# EAGLE design 09F-02 (EAGLE 6.3)
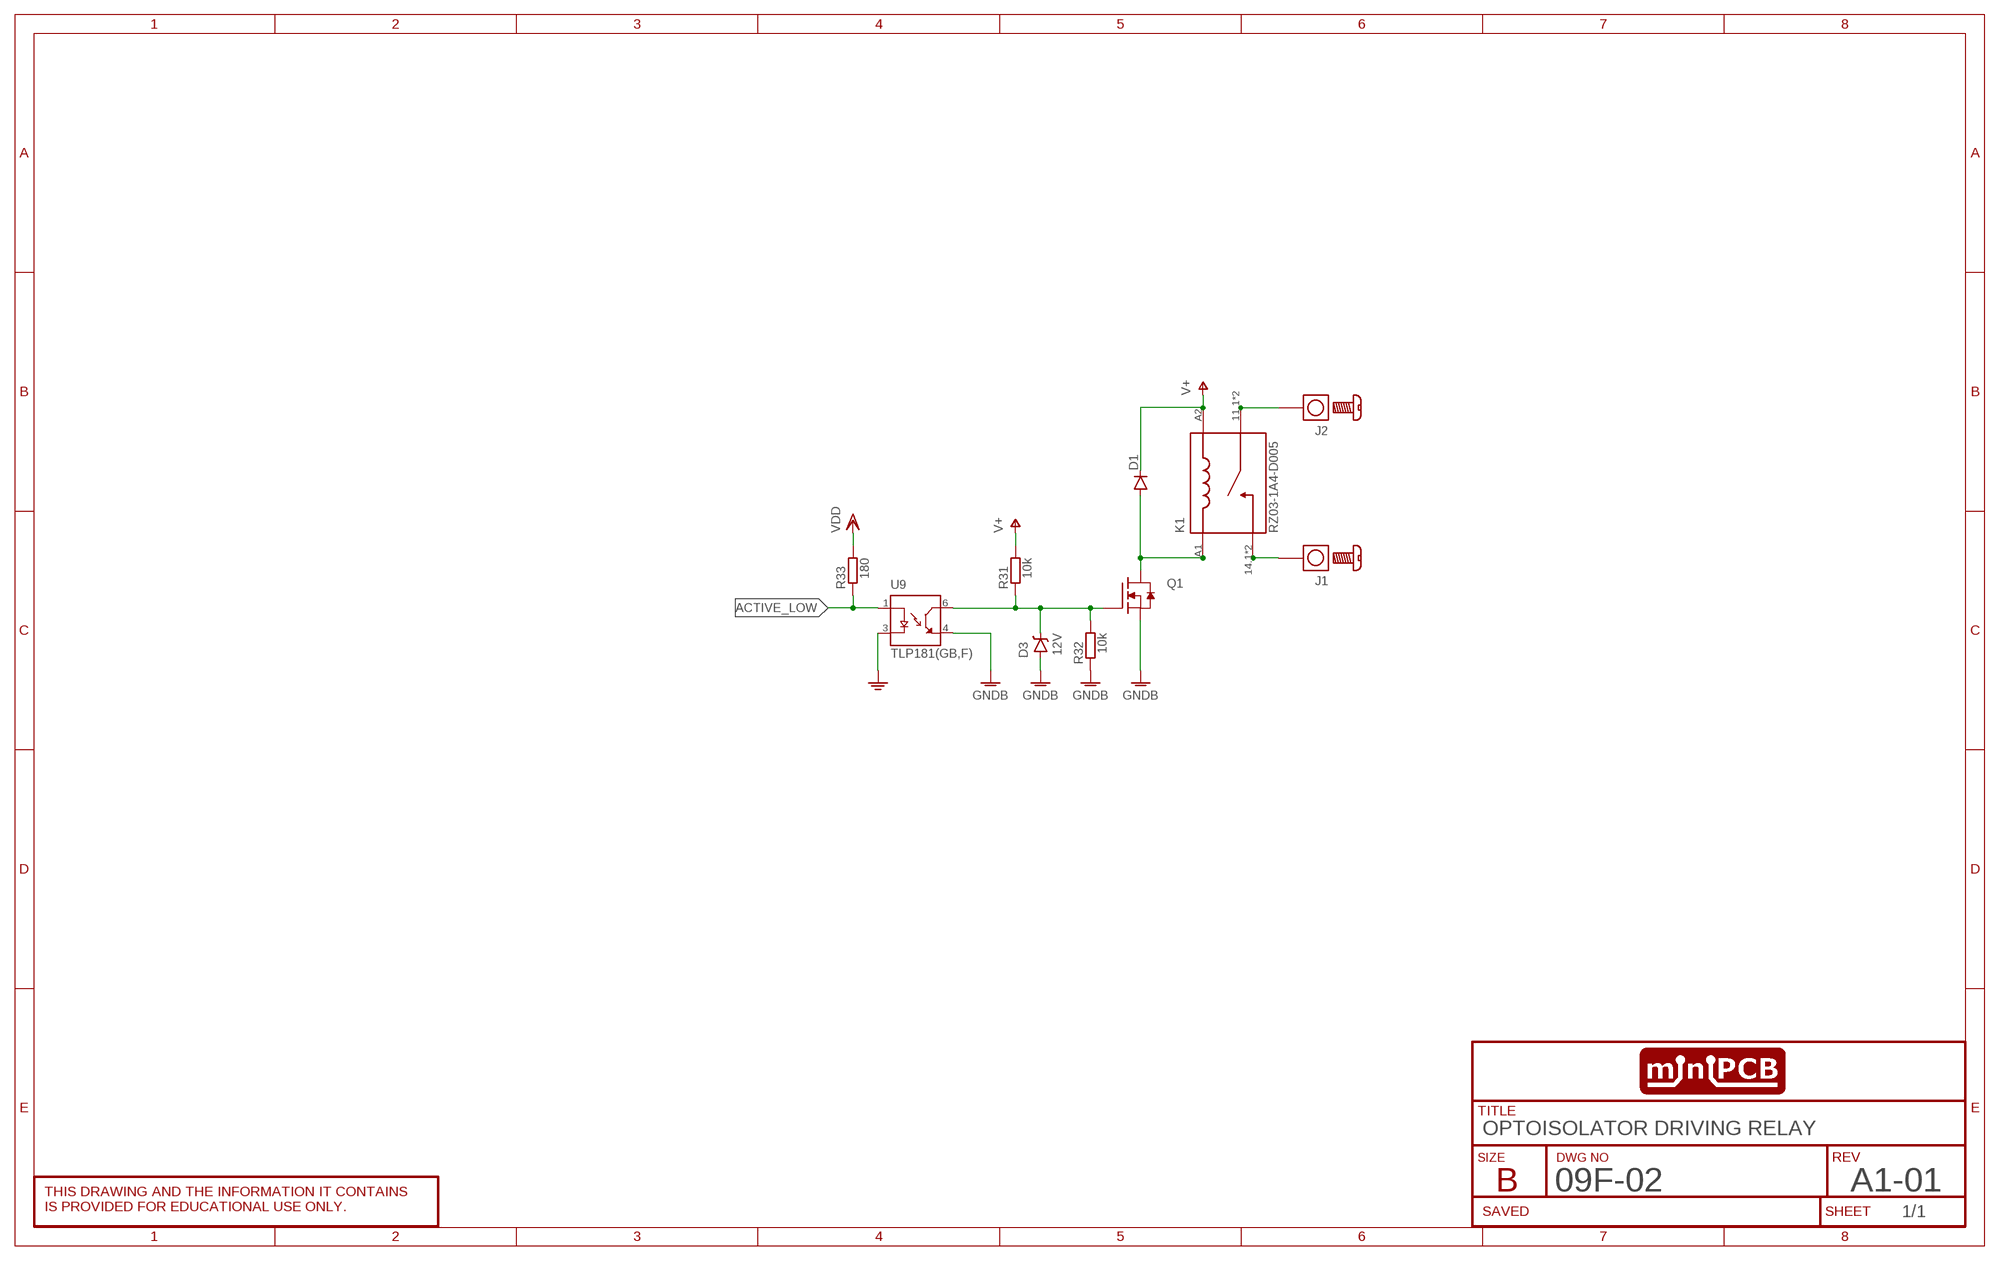
[diagram p0: schematic, sheet 1]
SHEET1 (SCHEMATIC): DWG_NO: 09F-01; REV: A1-01; TITLE: OPTOISOLATOR DRIVING RELAY

## Parts
D1  DIODE-SOD323-W  [SOD323-W]
D3  12V  ZENERSOT23  [SOT23]
J1  SCREW-TERMINAL  [SCREW-TERMINAL-M3]
J2  SCREW-TERMINAL  [SCREW-TERMINAL-M3]
K1  RZ03-1A4-D005  [RELAY_RZ03-1A4-D005]
Q1  MOSFET-NSOT23  [SOT23]
R31  10k  RESISTORSMD  [R0805]
R32  10k  RESISTORSMD  [R0805]
R33  180  RESISTORSMD  [R0805]
U9  TLP181(GB,F)  [SOIC254P700X280-4N]

## Nets
ACTIVE_LOW: R33.1 U9.1(A)
GND: U9.3(C)
GNDB: D3.1(A) Q1.2(S) R32.1 U9.4(ET)
N$1: J2.1 J2.2 J2.3 J2.4 K1.11.1 K1.11.2
N$2: J1.1 J1.2 J1.3 J1.4 K1.14.1 K1.14.2
N$29: D3.3(C) Q1.1(G) R31.1 R32.2 U9.6(CT)
N$31: D1.A K1.A1 Q1.3(D)
V+: D1.C K1.A2 R31.2
VDD: R33.2

## Library data of the parts
D1 = utsa:DIODE-: DIODE
D3 = minipcb:ZENER: Z-Diode
J1 J2 = minipcb:SCREW-TERMINAL; CIRCUIT_CATEGORY: CIRCUIT CATEGORY; REVISION: A1; TITLE: TITLE
K1 = utsa:RZ03-1A4-D005: Shrack; Relay Power PCB 16A SPST-NO 5VDC Check availability <https://pricing.snapeda.com/parts/RZ03-1A4-D005/TE%20Connectivity/view-part?ref=eda>; AVAILABILITY: In Stock; CHECK_PRICES: https://www.snapeda.com/parts/RZ03-1A4-D005/TE+Connectivity+Potter+%2526+Brumfield+Relays/view-part/?ref=eda; DESCRIPTION: Shrack, Relay Power PCB 16A SPST-NO 5VDC | TE Connectivity RZ03-1A4-D005; MF: TE Connectivity; MP: RZ03-1A4-D005; PACKAGE: None; PRICE: None; SNAPEDA_LINK: https://www.snapeda.com/parts/RZ03-1A4-D005/TE+Connectivity+Potter+%2526+Brumfield+Relays/view-part/?ref=snap
Q1 = minipcb:MOSFET-N
R31-R33 = minipcb:RESISTOR
U9 = minipcb:TLP181(GB,F): Check availability <https://pricing.snapeda.com/parts/TLP181%28GB%2CF%29/Toshiba/view-part?ref=eda>; AVAILABILITY: In Stock; CHECK_PRICES: https://www.snapeda.com/parts/TLP181(GB,F)/Toshiba/view-part/?ref=eda; DESCRIPTION: Optocouplers/Optoisolators, trans, Optoelectronics, optocoupler; MF: Toshiba; MP: TLP181(GB,F); PACKAGE: SO-4 Toshiba; PRICE: None; SNAPEDA_LINK: https://www.snapeda.com/parts/TLP181(GB,F)/Toshiba/view-part/?ref=snap

## Board
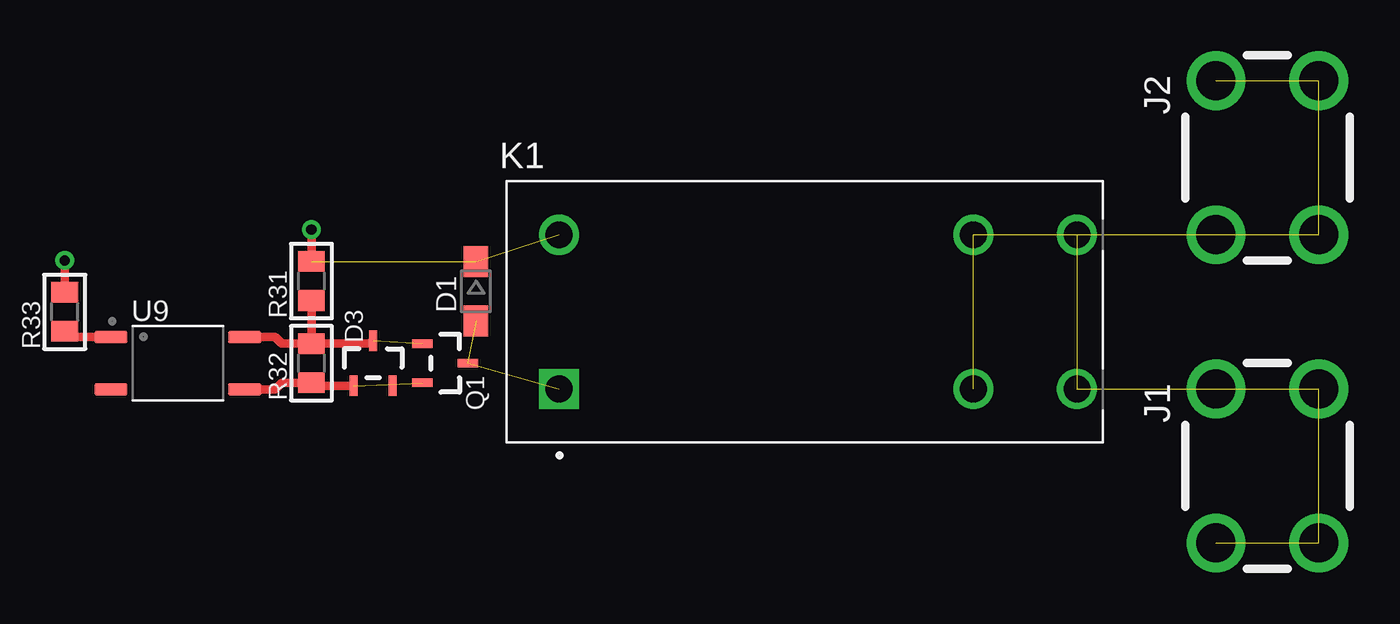
[diagram p1: board, top side]

No outline drawn. Coordinates in mm, seen from the top.
Copper layers (1*16): Top 0.035mm / dielectric 1.5mm / Bottom 0.035mm
Design rules "default": minimum track width 10mil, minimum drill 0.6mm, track to track 8mil, track to pad 8mil, pad to pad 8mil, via to via 8mil, smd to smd 8mil, copper to edge 40mil, drill to drill 8mil, minimum pad ring 10mil, minimum via ring 8mil, stop-mask expansion 4mil, vias tented up to drill 0mil, thermal gap 10mil

### Footprints (pad centres in the part's own frame; a part is rotated, then mirrored left to right if it is on the bottom)
SOD323-W = smd 1.5 x 1.2: A 1.45,0; C -1.45,0
SOT23 = smd 0.4 x 1: 1 -0.95,-1.1; 2 0.95,-1.1; 3 0,1.1
SCREW-TERMINAL-M3 = drill 1.9: 1 -2.5,3.75; 2 2.5,3.75; 3 -2.5,-3.75; 4 2.5,-3.75
RELAY_RZ03-1A4-D005 = drill 1.3: 11.1 8.2,-3.75; 11.2 8.2,3.75; 14.1 13.24,-3.75; 14.2 13.24,3.75; A2 -11.96,3.75 | drill 1.3 square: A1 -11.96,-3.75
R0805 = smd 1 x 1.3: 1 -0.95,0; 2 0.95,0
SOIC254P700X280-4N = smd 1.61 x 0.57: 1 -3.25,1.27; 3 -3.25,-1.27; 4 3.25,-1.27; 6 3.25,1.27

### Placement (x,y rotation side)
D1  14.5,3.5 270 top
D3  9.5,0 0 top
J1  53,-5 180 top
J2  53,10 180 top
K1  30.5,2.5 0 top
Q1  13,0 270 top
R31  6.5,4 90 top
R32  6.5,0 90 top
R33  -5.5,2.5 90 top
U9  0,0 0 top

### Tracks (layer width: path | path; a pad name or v marks a point on that pad's centre or on a via)
ACTIVE_LOW
  Top 0.406: R33.1 -5.22,1.27 U9.1
GNDB  (1 unrouted)
  Top 0.406: U9.4 4.73,-1.27 5.05,-0.95 R32.1 6.65,-1.1 D3.1
N$1  (5 unrouted)
N$2  (5 unrouted)
N$29  (1 unrouted)
  Top 0.406: U9.6 4.73,1.27 5.05,0.95 R32.2 | R31.1 R32.2 | D3.3 9.35,0.95 R32.2
N$31  (2 unrouted)
V+  (via drill 0.5)  (2 unrouted)
  Top 0.406: R31.2 v6.5,6.5
VDD  (via drill 0.5)
  Top 0.406: R33.2 v-5.5,5